# EAGLE design Infineon_Extension_Board (EAGLE 9.6.2)
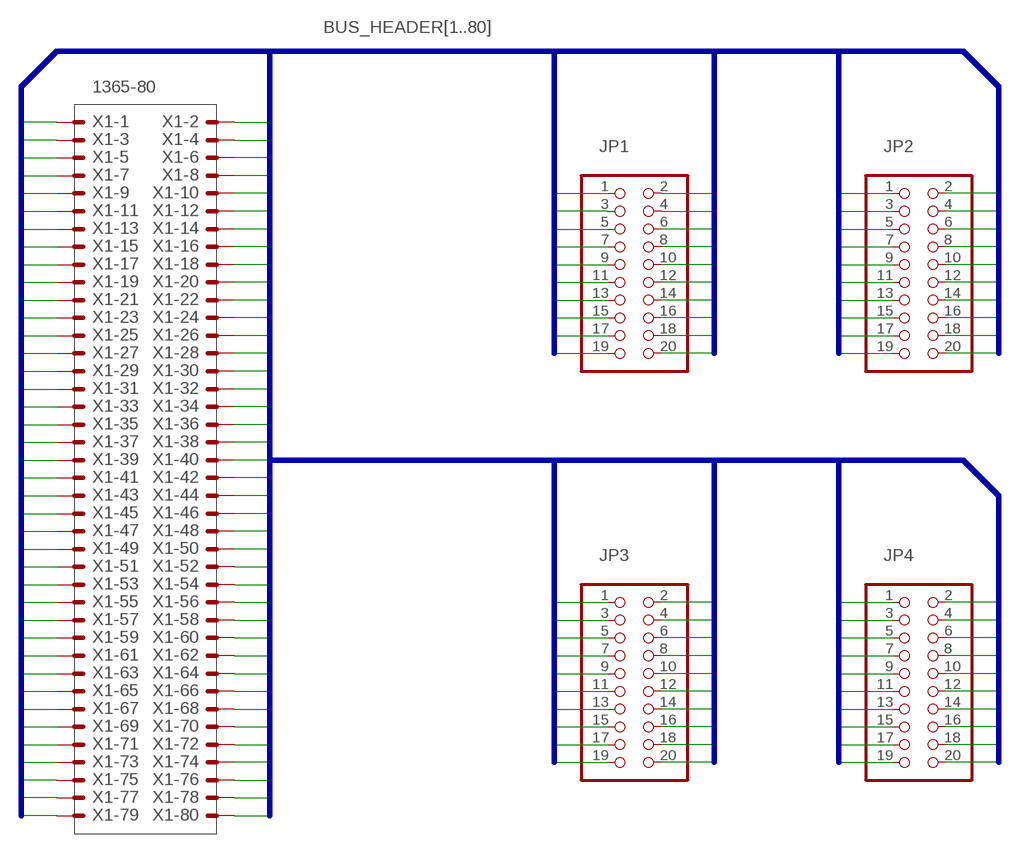
[diagram p0: schematic, sheet 1]

## Parts
JP1  PINHD-2X10  [2X10]
JP2  PINHD-2X10  [2X10]
JP3  PINHD-2X10  [2X10]
JP4  PINHD-2X10  [2X10]
X1  1365-80  [1365-80]

## Nets
BUS_HEADER1: JP1.1 X1.1
BUS_HEADER2: JP1.2 X1.2
BUS_HEADER3: JP1.3 X1.3
BUS_HEADER4: JP1.4 X1.4
BUS_HEADER5: JP1.5 X1.5
BUS_HEADER6: JP1.6 X1.6
BUS_HEADER7: JP1.7 X1.7
BUS_HEADER8: JP1.8 X1.8
BUS_HEADER9: JP1.9 X1.9
BUS_HEADER10: JP1.10 X1.10
BUS_HEADER11: JP1.11 X1.11
BUS_HEADER12: JP1.12 X1.12
BUS_HEADER13: JP1.13 X1.13
BUS_HEADER14: JP1.14 X1.14
BUS_HEADER15: JP1.15 X1.15
BUS_HEADER16: JP1.16 X1.16
BUS_HEADER17: JP1.17 X1.17
BUS_HEADER18: JP1.18 X1.18
BUS_HEADER19: JP1.19 X1.19
BUS_HEADER20: JP1.20 X1.20
BUS_HEADER21: JP2.1 X1.21
BUS_HEADER22: JP2.2 X1.22
BUS_HEADER23: JP2.3 X1.23
BUS_HEADER24: JP2.4 X1.24
BUS_HEADER25: JP2.5 X1.25
BUS_HEADER26: JP2.6 X1.26
BUS_HEADER27: JP2.7 X1.27
BUS_HEADER28: JP2.8 X1.28
BUS_HEADER29: JP2.9 X1.29
BUS_HEADER30: JP2.10 X1.30
BUS_HEADER31: JP2.11 X1.31
BUS_HEADER32: JP2.12 X1.32
BUS_HEADER33: JP2.13 X1.33
BUS_HEADER34: JP2.14 X1.34
BUS_HEADER35: JP2.15 X1.35
BUS_HEADER36: JP2.16 X1.36
BUS_HEADER37: JP2.17 X1.37
BUS_HEADER38: JP2.18 X1.38
BUS_HEADER39: JP2.19 X1.39
BUS_HEADER40: JP2.20 X1.40
BUS_HEADER41: JP3.1 X1.41
BUS_HEADER42: JP3.2 X1.42
BUS_HEADER43: JP3.3 X1.43
BUS_HEADER44: JP3.4 X1.44
BUS_HEADER45: JP3.5 X1.45
BUS_HEADER46: JP3.6 X1.46
BUS_HEADER47: JP3.7 X1.47
BUS_HEADER48: JP3.8 X1.48
BUS_HEADER49: JP3.9 X1.49
BUS_HEADER50: JP3.10 X1.50
BUS_HEADER51: JP3.11 X1.51
BUS_HEADER52: JP3.12 X1.52
BUS_HEADER53: JP3.13 X1.53
BUS_HEADER54: JP3.14 X1.54
BUS_HEADER55: JP3.15 X1.55
BUS_HEADER56: JP3.16 X1.56
BUS_HEADER57: JP3.17 X1.57
BUS_HEADER58: JP3.18 X1.58
BUS_HEADER59: JP3.19 X1.59
BUS_HEADER60: JP3.20 X1.60
BUS_HEADER61: JP4.1 X1.61
BUS_HEADER62: JP4.2 X1.62
BUS_HEADER63: JP4.3 X1.63
BUS_HEADER64: JP4.4 X1.64
BUS_HEADER65: JP4.5 X1.65
BUS_HEADER66: JP4.6 X1.66
BUS_HEADER67: JP4.7 X1.67
BUS_HEADER68: JP4.8 X1.68
BUS_HEADER69: JP4.9 X1.69
BUS_HEADER70: JP4.10 X1.70
BUS_HEADER71: JP4.11 X1.71
BUS_HEADER72: JP4.12 X1.72
BUS_HEADER73: JP4.13 X1.73
BUS_HEADER74: JP4.14 X1.74
BUS_HEADER75: JP4.15 X1.75
BUS_HEADER76: JP4.16 X1.76
BUS_HEADER77: JP4.17 X1.77
BUS_HEADER78: JP4.18 X1.78
BUS_HEADER79: JP4.19 X1.79
BUS_HEADER80: JP4.20 X1.80

## Buses
BUS_HEADER[1..80]

## Library data of the parts
JP1-JP4 = pinhead:PINHD-2X10: PIN HEADER
X1 = con-leotronics:1365-80: DUAL ROW STRAIGHT HEADER 1364 SERIES. 1.27mm x 1.27mm. Without Fixing Post. SMT Source: http://www.leotronics.co.uk/Conexcon/Data%20Sheets/sec.%20A/1364ing.pdf; OC_FARNELL: unknown; OC_NEWARK: unknown

## Board
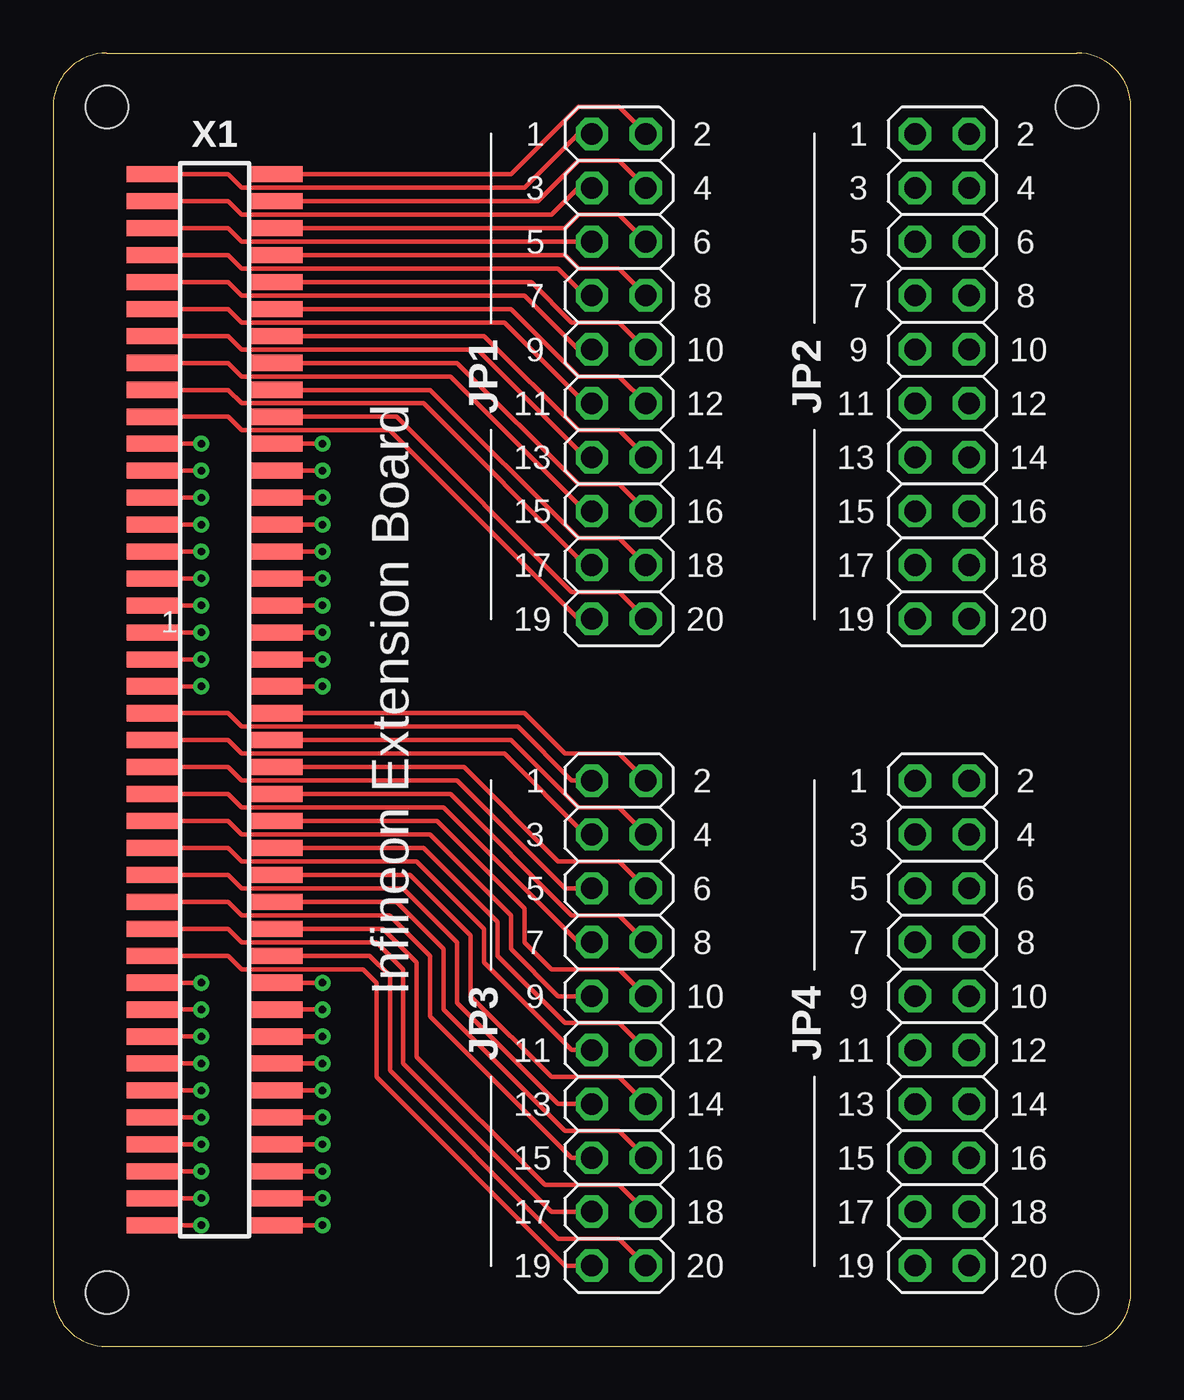
[diagram p1: board, top side]
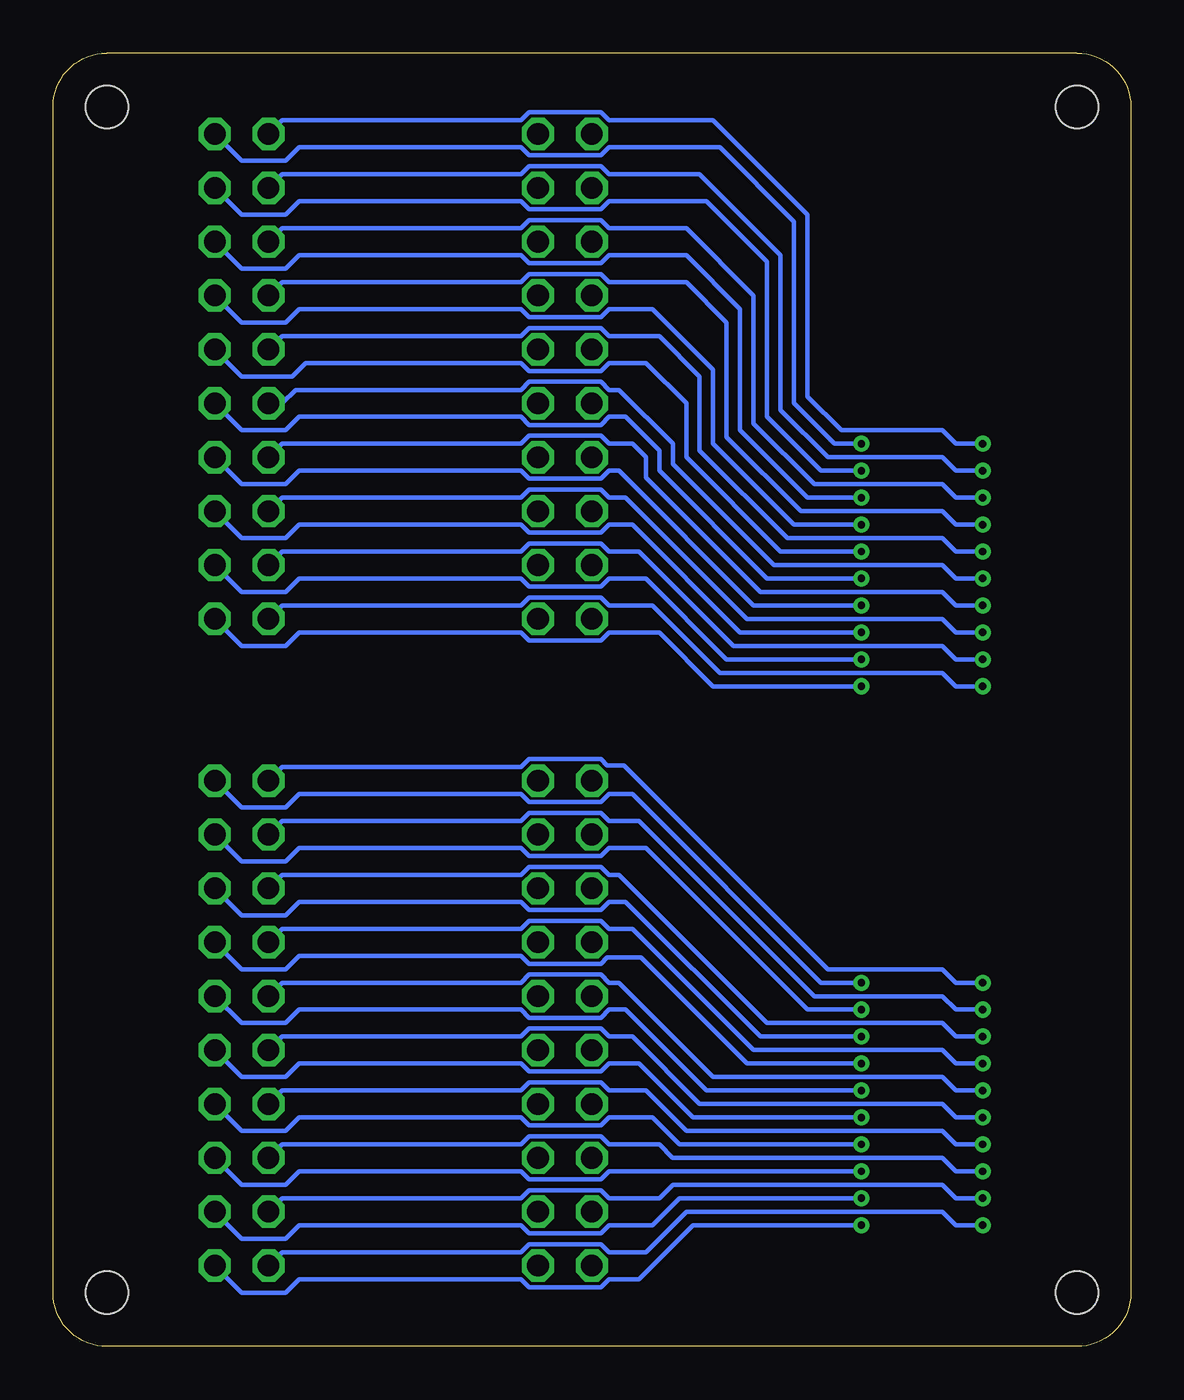
[diagram p2: board, bottom side, seen from below]

Size 50.8 x 60.96 mm. Coordinates in mm from the lower left corner, seen from the top.
Outline: 0,58.42 0,2.54 arc90 2.54,0 48.26,0 arc90 50.8,2.54 50.8,58.42 arc90 48.26,60.96 2.54,60.96 arc90 0,58.42
Copper layers (1*16): Top 0.035mm / dielectric 1.5mm / Bottom 0.035mm
Design rules "default": minimum track width 6mil, minimum drill 0.35mm, track to track 6mil, track to pad 6mil, pad to pad 6mil, via to via 6mil, smd to smd 6mil, copper to edge 40mil, drill to drill 6mil, minimum pad ring 10mil, minimum via ring 8mil, stop-mask expansion 4mil, vias tented up to drill 0mil, thermal gap 10mil
Holes 2 mm at 48.26,2.54 2.54,2.54 2.54,58.42 48.26,58.42

### Footprints (pad centres in the part's own frame; a part is rotated, then mirrored left to right if it is on the bottom)
2X10 = drill 1.016 octagon: 1 -11.43,-1.27; 2 -11.43,1.27; 3 -8.89,-1.27; 4 -8.89,1.27; 5 -6.35,-1.27; 6 -6.35,1.27; 7 -3.81,-1.27; 8 -3.81,1.27; 9 -1.27,-1.27; 10 -1.27,1.27; 11 1.27,-1.27; 12 1.27,1.27; 13 3.81,-1.27; 14 3.81,1.27; 15 6.35,-1.27; 16 6.35,1.27; 17 8.89,-1.27; 18 8.89,1.27; 19 11.43,-1.27; 20 11.43,1.27
1365-80 = smd 0.76 x 2.4: 1 -24.765,-2.95; 2 -24.765,2.95; 3 -23.495,-2.95; 4 -23.495,2.95; 5 -22.225,-2.95; 6 -22.225,2.95; 7 -20.955,-2.95; 8 -20.955,2.95; 9 -19.685,-2.95; 10 -19.685,2.95; 11 -18.415,-2.95; 12 -18.415,2.95; 13 -17.145,-2.95; 14 -17.145,2.95; 15 -15.875,-2.95; 16 -15.875,2.95; 17 -14.605,-2.95; 18 -14.605,2.95; 19 -13.335,-2.95; 20 -13.335,2.95; 21 -12.065,-2.95; 22 -12.065,2.95; 23 -10.795,-2.95; 24 -10.795,2.95; 25 -9.525,-2.95; 26 -9.525,2.95; 27 -8.255,-2.95; 28 -8.255,2.95; 29 -6.985,-2.95; 30 -6.985,2.95; 31 -5.715,-2.95; 32 -5.715,2.95; 33 -4.445,-2.95; 34 -4.445,2.95; 35 -3.175,-2.95; 36 -3.175,2.95; 37 -1.905,-2.95; 38 -1.905,2.95; 39 -0.635,-2.95; 40 -0.635,2.95; 41 0.635,-2.95; 42 0.635,2.95; 43 1.905,-2.95; 44 1.905,2.95; 45 3.175,-2.95; 46 3.175,2.95; 47 4.445,-2.95; 48 4.445,2.95; 49 5.715,-2.95; 50 5.715,2.95; 51 6.985,-2.95; 52 6.985,2.95; 53 8.255,-2.95; 54 8.255,2.95; 55 9.525,-2.95; 56 9.525,2.95; 57 10.795,-2.95; 58 10.795,2.95; 59 12.065,-2.95; 60 12.065,2.95; 61 13.335,-2.95; 62 13.335,2.95; 63 14.605,-2.95; 64 14.605,2.95; 65 15.875,-2.95; 66 15.875,2.95; 67 17.145,-2.95; 68 17.145,2.95; 69 18.415,-2.95; 70 18.415,2.95; 71 19.685,-2.95; 72 19.685,2.95; 73 20.955,-2.95; 74 20.955,2.95; 75 22.225,-2.95; 76 22.225,2.95; 77 23.495,-2.95; 78 23.495,2.95; 79 24.765,-2.95; 80 24.765,2.95

### Placement (x,y rotation side)
JP1  26.67,45.72 270 top
JP2  41.91,45.72 270 top
JP3  26.67,15.24 270 top
JP4  41.91,15.24 270 top
X1  7.62,30.48 270 top

### Tracks (layer width: path | path; a pad name or v marks a point on that pad's centre or on a via)
BUS_HEADER1
  Top 0.203: X1.1 8.26,55.24 8.89,54.61 22.23,54.61 24.77,57.15 JP1.1
BUS_HEADER2
  Top 0.203: JP1.2 26.67,58.42 24.77,58.42 21.59,55.24 X1.2
BUS_HEADER3
  Top 0.203: X1.3 8.26,53.98 8.89,53.34 23.5,53.34 24.77,54.61 JP1.3
BUS_HEADER4
  Top 0.203: JP1.4 26.67,55.88 24.77,55.88 22.86,53.98 X1.4
BUS_HEADER5
  Top 0.203: JP1.5 8.89,52.07 8.26,52.7 X1.5
BUS_HEADER6
  Top 0.203: X1.6 24.13,52.7 24.77,53.34 26.67,53.34 JP1.6
BUS_HEADER7
  Top 0.203: X1.7 8.26,51.44 8.89,50.8 23.81,50.8 25.08,49.53 JP1.7
BUS_HEADER8
  Top 0.203: JP1.8 26.67,50.8 24.77,50.8 24.13,51.44 X1.8
BUS_HEADER9
  Top 0.203: X1.9 8.26,50.16 8.89,49.53 22.22,49.53 24.77,46.99 JP1.9
BUS_HEADER10
  Top 0.203: JP1.10 26.67,48.26 24.45,48.26 22.54,50.16 X1.10
BUS_HEADER11
  Top 0.203: JP1.11 25.08,44.45 21.27,48.26 8.89,48.26 8.26,48.9 X1.11
BUS_HEADER12
  Top 0.203: JP1.12 26.67,45.72 24.77,45.72 21.59,48.9 X1.12
BUS_HEADER13
  Top 0.203: JP1.13 25.08,41.91 20,46.99 8.89,46.99 8.26,47.62 X1.13
BUS_HEADER14
  Top 0.203: X1.14 20.32,47.62 24.77,43.18 26.67,43.18 JP1.14
BUS_HEADER15
  Top 0.203: JP1.15 25.08,39.37 18.73,45.72 8.89,45.72 8.26,46.35 X1.15
BUS_HEADER16
  Top 0.203: JP1.16 26.67,40.64 24.77,40.64 19.05,46.35 X1.16
BUS_HEADER17
  Top 0.203: JP1.17 25.08,36.83 17.46,44.45 8.89,44.45 8.26,45.09 X1.17
BUS_HEADER18
  Top 0.203: JP1.18 26.67,38.1 24.77,38.1 17.78,45.09 X1.18
BUS_HEADER19
  Top 0.203: JP1.19 24.77,34.29 15.87,43.18 8.89,43.18 8.26,43.81 X1.19
BUS_HEADER20
  Top 0.203: JP1.20 26.67,35.56 24.45,35.56 16.19,43.81 X1.20
BUS_HEADER21  (via drill 0.35)
  Top 0.203: X1.21 v6.99,42.55
  Bottom 0.203: v6.99,42.55 8.26,42.55 8.89,43.18 13.65,43.18 15.24,44.77 15.24,53.34 19.68,57.78 24.6,57.78 24.98,58.17 28.36,58.17 28.74,57.78 40.01,57.78 JP2.1
BUS_HEADER22  (via drill 0.35)
  Top 0.203: X1.22 v12.7,42.55
  Bottom 0.203: JP2.2 41.91,55.88 39.84,55.88 39.2,56.52 28.74,56.52 28.36,56.13 24.98,56.13 24.6,56.52 19.37,56.52 15.88,53.02 15.88,44.45 13.97,42.55 v12.7,42.55
BUS_HEADER23  (via drill 0.35)
  Top 0.203: X1.23 v6.99,41.27
  Bottom 0.203: v6.99,41.27 8.26,41.27 8.89,41.91 14.29,41.91 16.51,44.13 16.51,51.44 20.32,55.24 24.6,55.24 24.98,55.63 28.36,55.63 28.74,55.24 40.01,55.24 JP2.3
BUS_HEADER24  (via drill 0.35)
  Top 0.203: X1.24 v12.7,41.27
  Bottom 0.203: JP2.4 41.91,53.34 39.84,53.34 39.2,53.98 28.74,53.98 28.36,53.59 24.98,53.59 24.6,53.98 20,53.98 17.14,51.12 17.14,43.81 14.61,41.27 v12.7,41.27
BUS_HEADER25  (via drill 0.35)
  Top 0.203: X1.25 v6.99,40.01
  Bottom 0.203: v6.99,40.01 8.26,40.01 8.89,40.64 14.92,40.64 17.78,43.5 17.78,49.53 20.95,52.7 24.6,52.7 24.98,53.09 28.36,53.09 28.74,52.7 40.01,52.7 JP2.5
BUS_HEADER26  (via drill 0.35)
  Top 0.203: X1.26 v12.7,40.01
  Bottom 0.203: JP2.6 41.91,50.8 39.84,50.8 39.2,51.44 28.74,51.44 28.36,51.05 24.98,51.05 24.6,51.44 20.95,51.44 18.41,48.9 18.41,43.18 15.24,40.01 v12.7,40.01
BUS_HEADER27  (via drill 0.35)
  Top 0.203: X1.27 v6.99,38.73
  Bottom 0.203: v6.99,38.73 8.26,38.73 8.89,39.37 15.56,39.37 19.05,42.86 19.05,48.26 20.95,50.16 24.6,50.16 24.98,50.55 28.36,50.55 28.74,50.16 40.01,50.16 JP2.7
BUS_HEADER28  (via drill 0.35)
  Top 0.203: X1.28 v12.7,38.73
  Bottom 0.203: JP2.8 41.91,48.26 39.84,48.26 39.2,48.9 28.74,48.9 28.36,48.51 24.98,48.51 24.6,48.9 22.54,48.9 19.68,46.04 19.68,42.55 15.88,38.73 v12.7,38.73
BUS_HEADER29  (via drill 0.35)
  Top 0.203: X1.29 v6.99,37.47
  Bottom 0.203: v6.99,37.47 8.26,37.47 8.89,38.1 16.19,38.1 20.32,42.23 20.32,45.72 22.23,47.62 24.6,47.62 24.98,48.01 28.36,48.01 28.74,47.62 40.01,47.62 JP2.9
BUS_HEADER30  (via drill 0.35)
  Top 0.203: X1.30 v12.7,37.47
  Bottom 0.203: JP2.10 41.91,45.72 39.52,45.72 38.89,46.35 28.74,46.35 28.36,45.97 24.98,45.97 24.6,46.35 22.86,46.35 20.95,44.45 20.95,41.91 16.51,37.47 v12.7,37.47
BUS_HEADER31  (via drill 0.35)
  Top 0.203: X1.31 v6.99,36.2
  Bottom 0.203: v6.99,36.2 8.26,36.2 8.89,36.83 16.83,36.83 21.59,41.59 21.59,42.55 24.13,45.09 24.6,45.09 24.98,45.47 28.36,45.47 28.74,45.09 39.37,45.09 40.01,44.45 JP2.11
BUS_HEADER32  (via drill 0.35)
  Top 0.203: X1.32 v12.7,36.2
  Bottom 0.203: JP2.12 41.91,43.18 39.84,43.18 39.2,43.81 28.74,43.81 28.36,43.43 24.98,43.43 24.6,43.81 23.81,43.81 22.23,42.23 22.23,41.27 17.14,36.2 v12.7,36.2
BUS_HEADER33  (via drill 0.35)
  Top 0.203: X1.33 v6.99,34.92
  Bottom 0.203: v6.99,34.92 8.26,34.92 8.89,35.56 17.46,35.56 22.86,40.96 22.86,41.91 23.5,42.55 24.6,42.55 24.98,42.93 28.36,42.93 28.74,42.55 40.01,42.55 JP2.13
BUS_HEADER34  (via drill 0.35)
  Top 0.203: X1.34 v12.7,34.92
  Bottom 0.203: JP2.14 41.91,40.64 39.84,40.64 39.2,41.27 28.74,41.27 28.36,40.89 24.98,40.89 24.6,41.27 24.13,41.27 17.78,34.92 v12.7,34.92
BUS_HEADER35  (via drill 0.35)
  Top 0.203: X1.35 v6.99,33.66
  Bottom 0.203: v6.99,33.66 8.26,33.66 8.89,34.29 18.1,34.29 23.81,40.01 24.6,40.01 24.98,40.39 28.36,40.39 28.74,40.01 40.01,40.01 JP2.15
BUS_HEADER36  (via drill 0.35)
  Top 0.203: X1.36 v12.7,33.66
  Bottom 0.203: JP2.16 41.91,38.1 39.84,38.1 39.2,38.73 28.74,38.73 28.36,38.35 24.98,38.35 24.6,38.73 23.5,38.73 18.41,33.66 v12.7,33.66
BUS_HEADER37  (via drill 0.35)
  Top 0.203: X1.37 v6.99,32.38
  Bottom 0.203: v6.99,32.38 8.26,32.38 8.89,33.02 18.73,33.02 23.18,37.47 24.6,37.47 24.98,37.85 28.36,37.85 28.74,37.47 40.01,37.47 JP2.17
BUS_HEADER38  (via drill 0.35)
  Top 0.203: X1.38 v12.7,32.38
  Bottom 0.203: JP2.18 41.91,35.56 39.84,35.56 39.2,36.2 28.74,36.2 28.36,35.81 24.98,35.81 24.6,36.2 22.86,36.2 19.05,32.38 v12.7,32.38
BUS_HEADER39  (via drill 0.35)
  Top 0.203: X1.39 v6.99,31.11
  Bottom 0.203: v6.99,31.11 8.26,31.11 8.89,31.75 19.37,31.75 22.54,34.92 24.6,34.92 24.98,35.31 28.36,35.31 28.74,34.92 40.01,34.92 JP2.19
BUS_HEADER40  (via drill 0.35)
  Top 0.203: v12.7,31.11 X1.40
  Bottom 0.203: JP2.20 41.91,33.02 39.84,33.02 39.2,33.66 28.74,33.66 28.36,33.27 24.98,33.27 24.6,33.66 22.23,33.66 19.68,31.11 v12.7,31.11
BUS_HEADER41
  Top 0.203: X1.41 8.26,29.84 8.89,29.21 21.91,29.21 24.45,26.67 JP3.1
BUS_HEADER42
  Top 0.203: X1.42 22.23,29.84 24.13,27.94 26.67,27.94 JP3.2
BUS_HEADER43
  Top 0.203: X1.43 8.26,28.57 8.89,27.94 21.27,27.94 25.08,24.13 JP3.3
BUS_HEADER44
  Top 0.203: JP3.4 26.67,25.4 24.77,25.4 21.59,28.57 X1.44
BUS_HEADER45
  Top 0.203: X1.45 8.26,27.3 8.89,26.67 19.05,26.67 24.13,21.59 JP3.5
BUS_HEADER46
  Top 0.203: X1.46 19.37,27.3 23.81,22.86 26.67,22.86 JP3.6
BUS_HEADER47
  Top 0.203: JP3.7 24.77,19.05 18.41,25.4 8.89,25.4 8.26,26.04 X1.47
BUS_HEADER48
  Top 0.203: JP3.8 26.67,20.32 24.45,20.32 18.73,26.04 X1.48
BUS_HEADER49
  Top 0.203: JP3.9 23.81,16.51 21.59,18.73 21.59,20.32 17.78,24.13 8.89,24.13 8.26,24.77 X1.49
BUS_HEADER50
  Top 0.203: JP3.10 26.67,17.78 23.5,17.78 22.23,19.05 22.23,20.64 18.1,24.77 X1.50
BUS_HEADER51
  Top 0.203: JP3.11 24.45,13.97 20.32,18.1 20.32,19.68 17.14,22.86 8.89,22.86 8.26,23.5 X1.51
BUS_HEADER52
  Top 0.203: JP3.12 26.67,15.24 24.13,15.24 20.95,18.41 20.95,20 17.46,23.5 X1.52
BUS_HEADER53
  Top 0.203: JP3.13 23.81,11.43 19.05,16.19 19.05,19.05 16.51,21.59 8.89,21.59 8.26,22.23 X1.53
BUS_HEADER54
  Top 0.203: JP3.14 26.67,12.7 23.5,12.7 19.68,16.51 19.68,19.37 16.83,22.23 X1.54
BUS_HEADER55
  Top 0.203: JP3.15 24.45,8.89 17.78,15.56 17.78,18.41 15.87,20.32 8.89,20.32 8.26,20.95 X1.55
BUS_HEADER56
  Top 0.203: JP3.16 26.67,10.16 24.13,10.16 18.41,15.88 18.41,18.73 16.19,20.95 X1.56
BUS_HEADER57
  Top 0.203: JP3.17 23.5,6.35 16.51,13.34 16.51,17.78 15.24,19.05 8.89,19.05 8.26,19.68 X1.57
BUS_HEADER58
  Top 0.203: JP3.18 26.67,7.62 23.18,7.62 17.14,13.65 17.14,18.1 15.56,19.68 X1.58
BUS_HEADER59
  Top 0.203: X1.59 8.26,18.41 8.89,17.78 14.61,17.78 15.24,17.14 15.24,12.7 24.13,3.81 JP3.19
BUS_HEADER60
  Top 0.203: X1.60 14.92,18.41 15.88,17.46 15.88,13.02 23.81,5.08 26.67,5.08 JP3.20
BUS_HEADER61  (via drill 0.35)
  Top 0.203: X1.61 v6.99,17.14
  Bottom 0.203: JP4.1 40.01,27.3 28.74,27.3 28.36,27.69 24.98,27.69 24.68,27.39 23.9,27.39 14.29,17.78 8.89,17.78 8.26,17.14 v6.99,17.14
BUS_HEADER62  (via drill 0.35)
  Top 0.203: v12.7,17.14 X1.62
  Bottom 0.203: JP4.2 41.91,25.4 39.84,25.4 39.2,26.04 28.74,26.04 28.36,25.65 24.98,25.65 24.6,26.04 23.5,26.04 14.61,17.14 v12.7,17.14
BUS_HEADER63  (via drill 0.35)
  Top 0.203: X1.63 v6.99,15.88
  Bottom 0.203: JP4.3 40.01,24.77 28.74,24.77 28.36,25.15 24.98,25.15 24.6,24.77 23.18,24.77 14.92,16.51 8.89,16.51 8.26,15.88 v6.99,15.88
BUS_HEADER64  (via drill 0.35)
  Top 0.203: v12.7,15.88 X1.64
  Bottom 0.203: JP4.4 41.91,22.86 39.84,22.86 39.2,23.5 28.74,23.5 28.36,23.11 24.98,23.11 24.6,23.5 22.86,23.5 15.24,15.88 v12.7,15.88
BUS_HEADER65  (via drill 0.35)
  Top 0.203: X1.65 v6.99,14.61
  Bottom 0.203: JP4.5 40.01,22.23 28.74,22.23 28.36,22.61 24.98,22.61 24.6,22.23 24.13,22.23 17.14,15.24 8.89,15.24 8.26,14.61 v6.99,14.61
BUS_HEADER66  (via drill 0.35)
  Top 0.203: v12.7,14.61 X1.66
  Bottom 0.203: JP4.6 41.91,20.32 39.84,20.32 39.2,20.95 28.74,20.95 28.36,20.57 24.98,20.57 24.6,20.95 23.81,20.95 17.46,14.61 v12.7,14.61
BUS_HEADER67  (via drill 0.35)
  Top 0.203: X1.67 v6.99,13.34
  Bottom 0.203: JP4.7 40.01,19.68 28.74,19.68 28.36,20.07 24.98,20.07 24.6,19.68 23.5,19.68 17.78,13.97 8.89,13.97 8.26,13.34 v6.99,13.34
BUS_HEADER68  (via drill 0.35)
  Top 0.203: v12.7,13.34 X1.68
  Bottom 0.203: JP4.8 41.91,17.78 39.84,17.78 39.2,18.41 28.74,18.41 28.36,18.03 24.98,18.03 24.68,18.33 23.09,18.33 18.1,13.34 v12.7,13.34
BUS_HEADER69  (via drill 0.35)
  Top 0.203: X1.69 v6.99,12.06
  Bottom 0.203: JP4.9 40.01,17.14 28.74,17.14 28.36,17.53 24.98,17.53 24.6,17.14 24.13,17.14 19.69,12.7 8.89,12.7 8.26,12.06 v6.99,12.06
BUS_HEADER70  (via drill 0.35)
  Top 0.203: v12.7,12.06 X1.70
  Bottom 0.203: JP4.10 41.91,15.24 39.84,15.24 39.2,15.88 28.74,15.88 28.36,15.49 24.98,15.49 24.6,15.88 23.81,15.88 20,12.06 v12.7,12.06
BUS_HEADER71  (via drill 0.35)
  Top 0.203: X1.71 v6.99,10.79
  Bottom 0.203: JP4.11 40.01,14.61 28.74,14.61 28.36,14.99 24.98,14.99 24.6,14.61 23.5,14.61 20.32,11.43 8.89,11.43 8.26,10.79 v6.99,10.79
BUS_HEADER72  (via drill 0.35)
  Top 0.203: v12.7,10.79 X1.72
  Bottom 0.203: JP4.12 41.91,12.7 39.84,12.7 39.2,13.34 28.74,13.34 28.36,12.95 24.98,12.95 24.6,13.34 23.18,13.34 20.64,10.79 v12.7,10.79
BUS_HEADER73  (via drill 0.35)
  Top 0.203: X1.73 v6.99,9.53
  Bottom 0.203: JP4.13 40.01,12.06 28.74,12.06 28.36,12.45 24.98,12.45 24.6,12.06 22.86,12.06 20.95,10.16 8.89,10.16 8.26,9.53 v6.99,9.53
BUS_HEADER74  (via drill 0.35)
  Top 0.203: v12.7,9.53 X1.74
  Bottom 0.203: v12.7,9.53 21.27,9.53 22.54,10.79 24.6,10.79 24.98,10.41 28.36,10.41 28.74,10.79 39.2,10.79 39.84,10.16 41.91,10.16 JP4.14
BUS_HEADER75  (via drill 0.35)
  Top 0.203: X1.75 v6.99,8.26
  Bottom 0.203: JP4.15 40.01,9.53 28.74,9.53 28.36,9.91 24.98,9.91 24.6,9.53 22.23,9.53 21.59,8.89 8.89,8.89 8.26,8.26 v6.99,8.26
BUS_HEADER76  (via drill 0.35)
  Top 0.203: v12.7,8.26 X1.76
  Bottom 0.203: JP4.16 41.91,7.62 39.84,7.62 39.2,8.26 28.74,8.26 28.36,7.87 24.98,7.87 24.6,8.26 v12.7,8.26
BUS_HEADER77  (via drill 0.35)
  Top 0.203: X1.77 v6.99,6.99
  Bottom 0.203: JP4.17 40.01,6.99 28.74,6.99 28.36,7.37 24.98,7.37 24.6,6.99 22.23,6.99 21.59,7.62 8.89,7.62 8.26,6.99 v6.99,6.99
BUS_HEADER78  (via drill 0.35)
  Top 0.203: v12.7,6.99 X1.78
  Bottom 0.203: v12.7,6.99 21.27,6.99 22.54,5.71 24.6,5.71 24.98,5.33 28.36,5.33 28.74,5.71 39.2,5.71 39.84,5.08 41.91,5.08 JP4.18
BUS_HEADER79  (via drill 0.35)
  Top 0.203: v6.99,5.71 X1.79
  Bottom 0.203: JP4.19 40.01,4.45 28.74,4.45 28.36,4.83 24.98,4.83 24.6,4.45 22.86,4.45 20.95,6.35 8.89,6.35 8.26,5.71 v6.99,5.71
BUS_HEADER80  (via drill 0.35)
  Top 0.203: X1.80 v12.7,5.71
  Bottom 0.203: JP4.20 41.91,2.54 39.84,2.54 39.2,3.17 28.74,3.17 28.36,2.79 24.98,2.79 24.6,3.17 23.18,3.17 20.64,5.71 v12.7,5.71

### Text on the board
tNames: 1 | 2 | 1 | 2 | 3 | 4 | 3 | 4 | 5 | 6 | 5 | 6 | 7 | 8 | 7 | 8 | 9 | 10 | 9 | 10 | 11 | 12 | 11 | 12 | 13 | 14 | 13 | 14 | 15 | 16 | 15 | 16 | 17 | 18 | 17 | 18 | 1 | 19 | 20 | 19 | 20 | Infineon Extension Board | 1 | 2 | 1 | 2 | 3 | 4 | 3 | 4 | 5 | 6 | 5 | 6 | 7 | 8 | 7 | 8 | 9 | 10 | 9 | 10 | 11 | 12 | 11 | 12 | 13 | 14 | 13 | 14 | 15 | 16 | 15 | 16 | 17 | 18 | 17 | 18 | 19 | 20 | 19 | 20